# Altium schematic sheet Power_supply.SchDoc
size A4; SheetNumber: 4; SheetTotal: 6
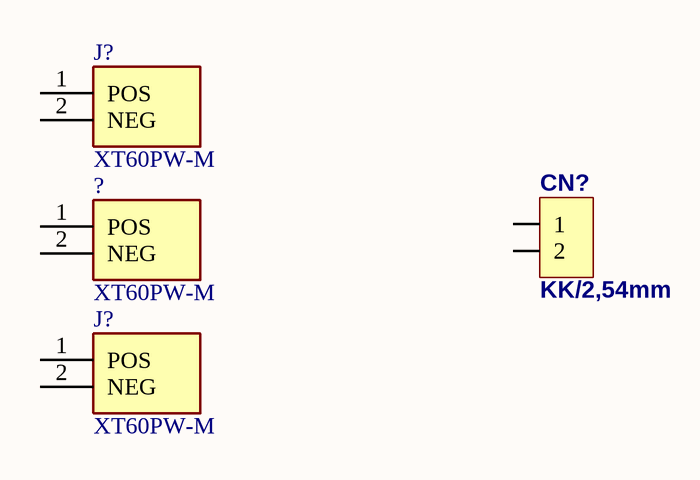
[diagram p0: Power_supply.SchDoc]

## Parts
(Parts that share a designator on the sheet are numbered #1, #2 ... from top to bottom, then left to right.)
?  XT60PW-M  [AMASS_XT60PW-M]
CN?  KK/2,54mm  [KK/2.54/2]
J?#1  XT60PW-M  [AMASS_XT60PW-M]
J?#2  XT60PW-M  [AMASS_XT60PW-M]

## Nets

Not connected (* = marked no-connect by the designer): ? 1(POS) 2(NEG); CN? 1 2; J?#1 1(POS) 2(NEG); J?#2 1(POS) 2(NEG)

## Library data of the parts
? J?#1 J?#2 = XT60PW-M: Socket, DC supply, male, PIN: 2; MF: AMASS; Check_prices: https://www.snapeda.com/parts/XT60PW-M/AMASS/view-part/?ref=eda; SnapEDA_Link: https://www.snapeda.com/parts/XT60PW-M/AMASS/view-part/?ref=snap; Price: None; Availability: Not in stock; Package: Package; MP: XT60PW-M; Value: *
CN? = CN_2x1: Connector: PCB-cable; KK; socket; male; PIN:2; straight/right-angle; tinned; THT